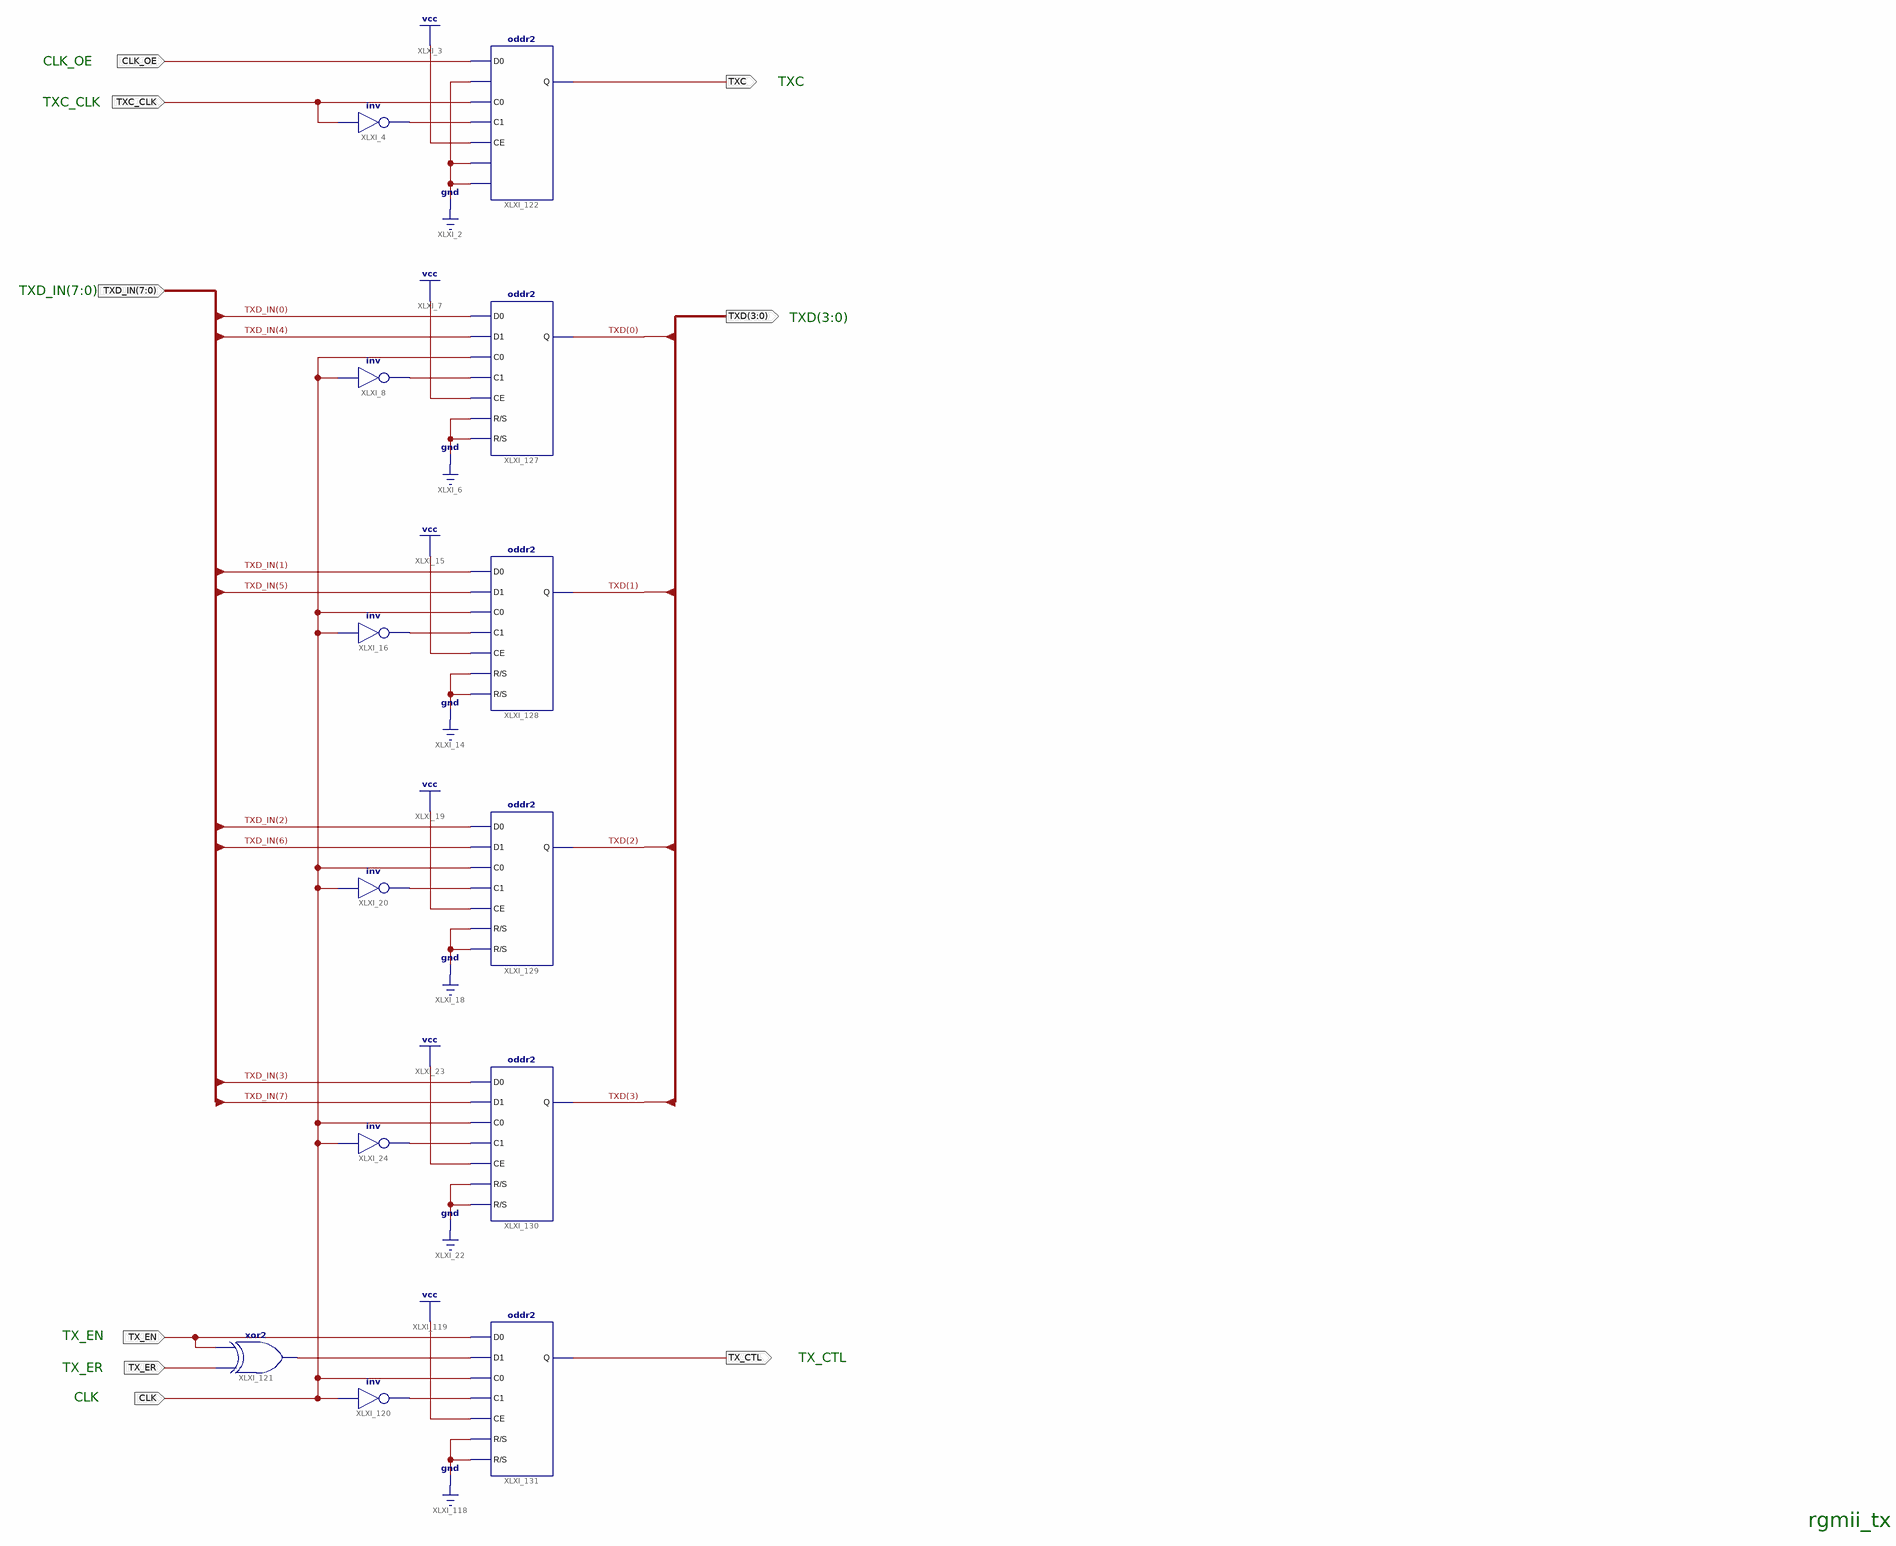
[diagram p0: schematic sheet 1]
// Xilinx ISE schematic rgmii_tx.sch (spartan6) as structural Verilog: 13 symbols, 9 ports
module rgmii_tx (
  input  TXC_CLK,
  input  CLK,
  input  TX_EN,
  input  [7:0] TXD_IN,
  input  TX_ER,
  input  CLK_OE,
  output TXC,
  output TX_CTL,
  output [3:0] TXD
);

  wire XLXN_6, XLXN_12, XLXN_22, XLXN_29, XLXN_36, XLXN_196, XLXN_208;

  not XLXI_4 (XLXN_6, TXC_CLK);
  not XLXI_8 (XLXN_12, CLK);
  not XLXI_16 (XLXN_22, CLK);
  not XLXI_20 (XLXN_29, CLK);
  not XLXI_24 (XLXN_36, CLK);
  not XLXI_120 (XLXN_196, CLK);
  xor XLXI_121 (XLXN_208, TX_ER, TX_EN);
  oddr2 #(.DDR_ALIGNMENT("C0"), .SRTYPE("ASYNC")) XLXI_122 (
    .D0(CLK_OE), .D1(1'b0), .C0(TXC_CLK), .C1(XLXN_6), .CE(1'b1), .R(1'b0), .Q(TXC), .S(1'b0));
  oddr2 #(.DDR_ALIGNMENT("C0"), .SRTYPE("ASYNC")) XLXI_127 (
    .D0(TXD_IN[0]), .D1(TXD_IN[4]), .C0(CLK), .C1(XLXN_12), .CE(1'b1), .R(1'b0), .Q(TXD[0]), .S(1'b0));
  oddr2 #(.DDR_ALIGNMENT("C0"), .SRTYPE("ASYNC")) XLXI_128 (
    .D0(TXD_IN[1]), .D1(TXD_IN[5]), .C0(CLK), .C1(XLXN_22), .CE(1'b1), .R(1'b0), .Q(TXD[1]), .S(1'b0));
  oddr2 #(.DDR_ALIGNMENT("C0"), .SRTYPE("ASYNC")) XLXI_129 (
    .D0(TXD_IN[2]), .D1(TXD_IN[6]), .C0(CLK), .C1(XLXN_29), .CE(1'b1), .R(1'b0), .Q(TXD[2]), .S(1'b0));
  oddr2 #(.DDR_ALIGNMENT("C0"), .SRTYPE("ASYNC")) XLXI_130 (
    .D0(TXD_IN[3]), .D1(TXD_IN[7]), .C0(CLK), .C1(XLXN_36), .CE(1'b1), .R(1'b0), .Q(TXD[3]), .S(1'b0));
  oddr2 #(.DDR_ALIGNMENT("C0"), .SRTYPE("ASYNC")) XLXI_131 (
    .D0(TX_EN), .D1(XLXN_208), .C0(CLK), .C1(XLXN_196), .CE(1'b1), .R(1'b0), .Q(TX_CTL), .S(1'b0));

  // Notes on the sheet:
  //   CLK_OE
  //   TXC
  //   TXC_CLK
  //   TXD_IN(7:0)
  //   TXD(3:0)
  //   TX_EN
  //   TX_CTL
  //   TX_ER
  //   CLK
  //   rgmii_tx
endmodule
